# Altium schematic sheet HK32L08x-EVAL.SchDoc
size A3
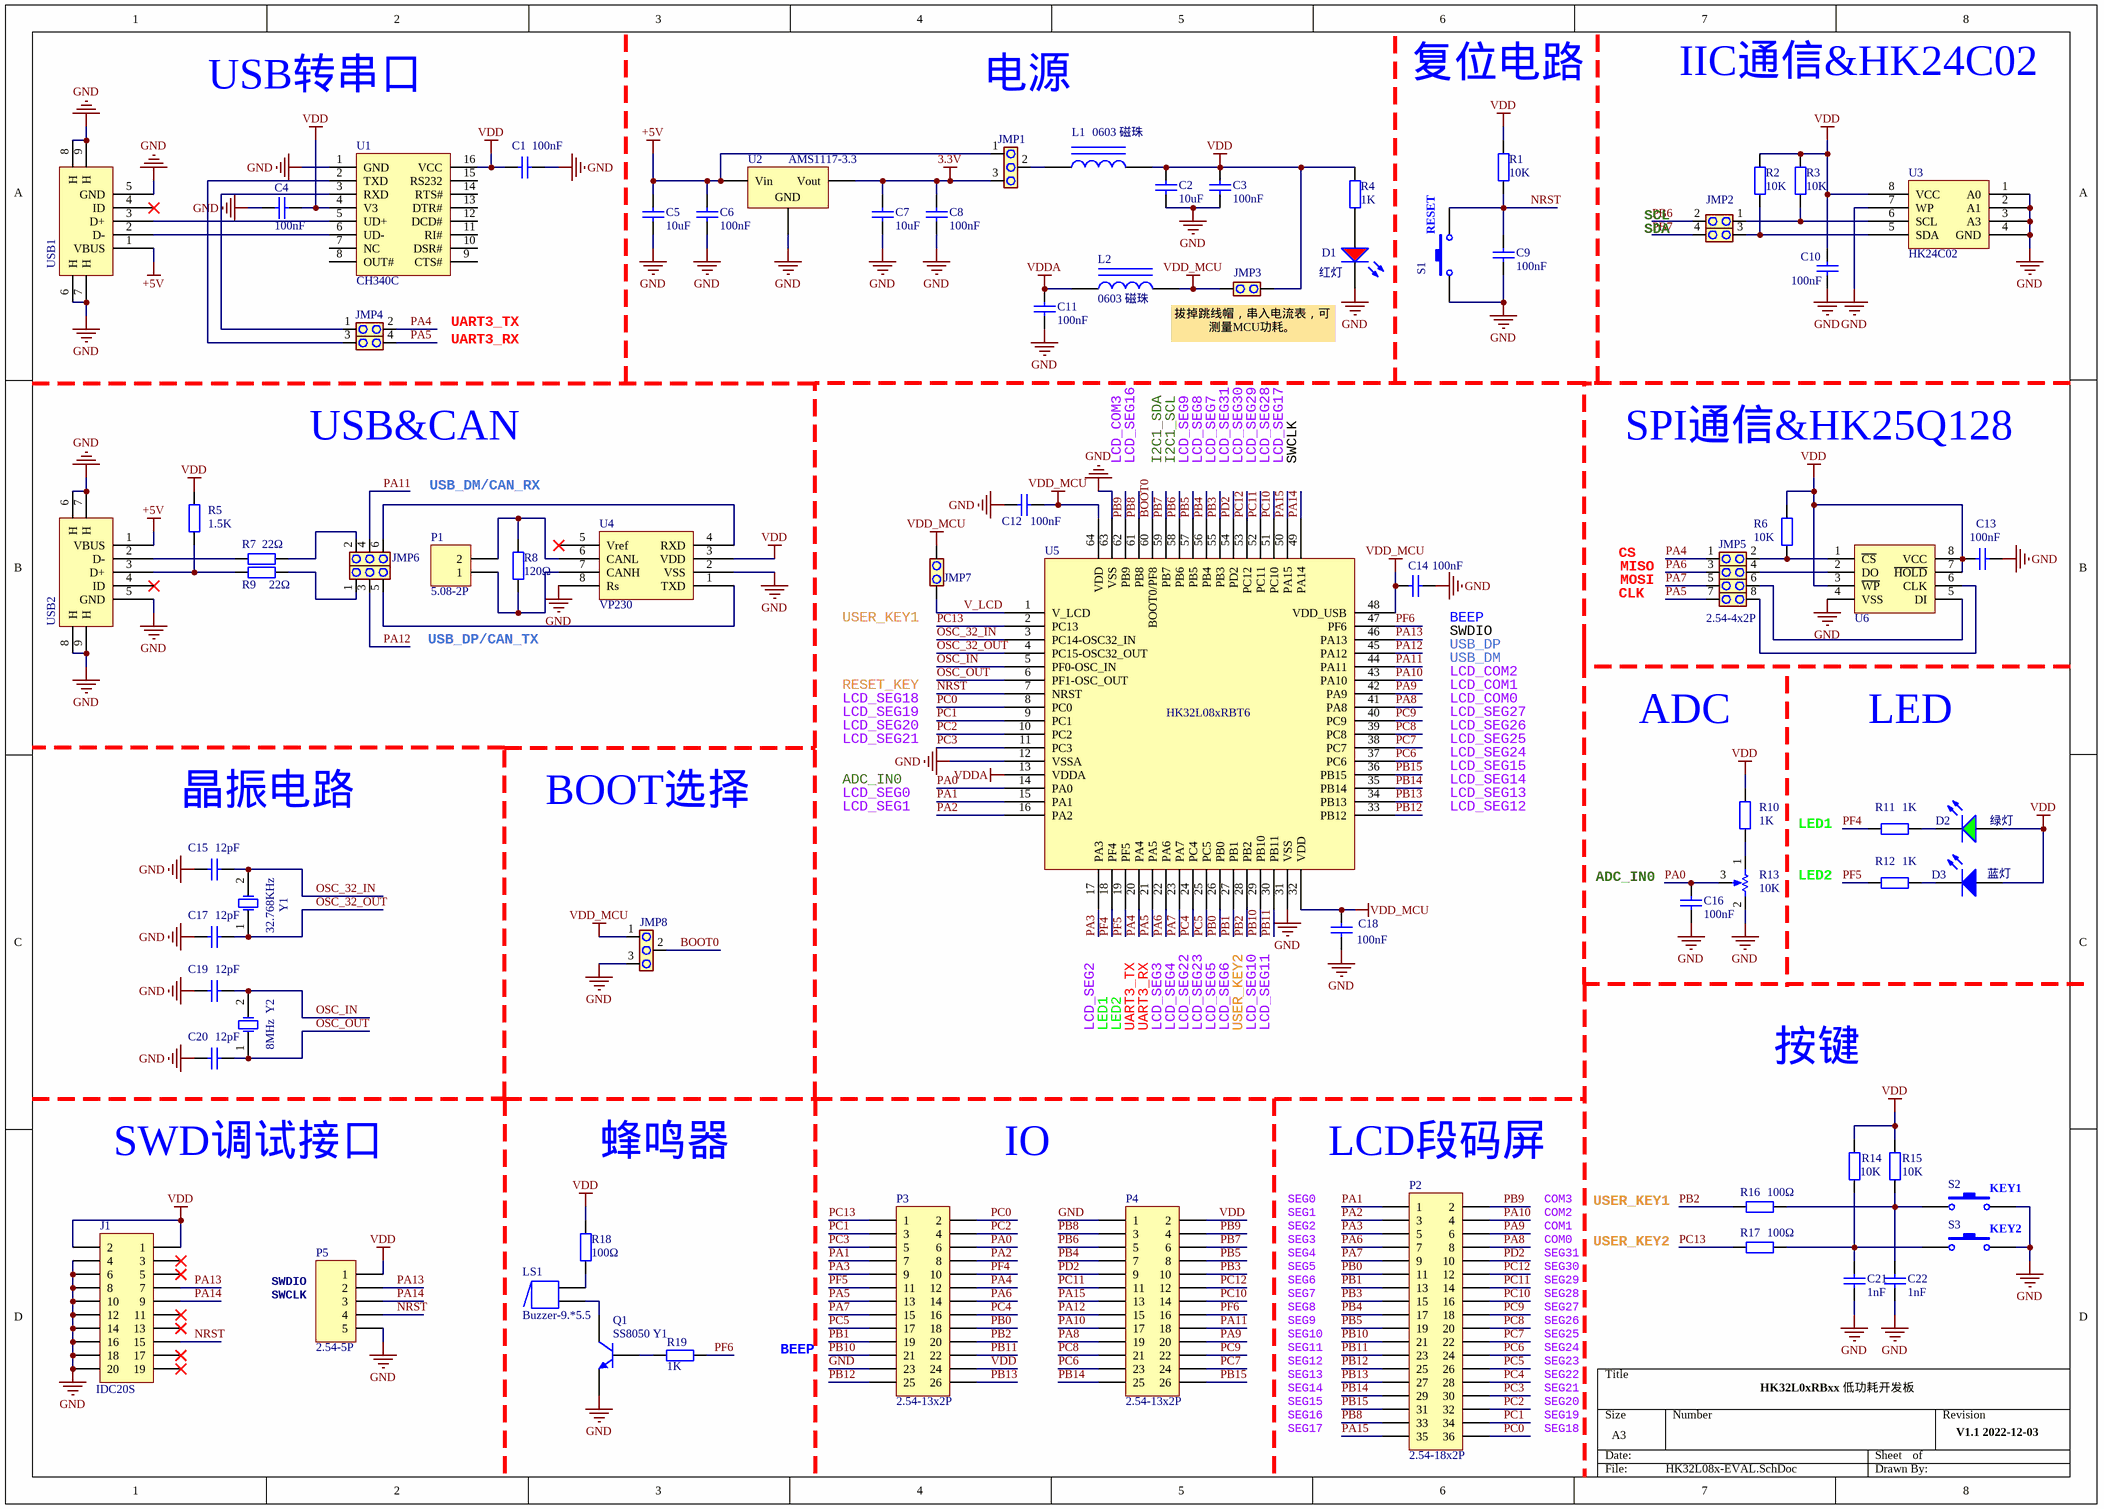
[diagram p0: HK32L08x-EVAL.SchDoc]

## Parts
C1  100nF  [LC-0603_C]
C2  10uF  [LC-0603_C]
C3  100nF  [LC-0603_C]
C4  100nF  [LC-0603_C]
C5  10uF  [LC-1206_C]
C6  100nF  [LC-0603_C]
C7  10uF  [LC-1206_C]
C8  100nF  [LC-0603_C]
C9  100nF  [LC-0603_C]
C10  100nF  [LC-0603_C]
C11  100nF  [LC-0603_C]
C12  100nF  [LC-0603_C]
C13  100nF  [LC-0603_C]
C14  100nF  [LC-0603_C]
C15  12pF  [LC-0603_C]
C16  100nF  [LC-0603_C]
C17  12pF  [LC-0603_C]
C18  100nF  [LC-0603_C]
C19  12pF  [LC-0603_C]
C20  12pF  [LC-0603_C]
C21  1nF  [LC-0603_C]
C22  1nF  [LC-0603_C]
D1  红灯  [LC-0603_LED_S1]
D2  绿灯  [LC-0603_LED_S1]
D3  蓝灯  [LC-0603_LED_S1]
J1  IDC20S  [JTAG20P]
JMP1  2.54-3P  [HDR1X3]  (value not drawn)
JMP2  2.54-2x2P  [HDR2X2]  (value not drawn)
JMP3  2.54-2x1  [HDR1X2]  (value not drawn)
JMP4  2.54-2x2P  [HDR2X2]  (value not drawn)
JMP5  2.54-4x2P  [HDR2X4]
JMP6  2.54-3x2P  [HDR2X3]  (value not drawn)
JMP7  2.54-2P  [HDR1X2]  (value not drawn)
JMP8  2.54-3P  [HDR1X3]  (value not drawn)
L1  0603 磁珠  [LC-0603_L]
L2  0603 磁珠  [LC-0603_L]
LS1  Buzzer-9.*5.5  [Buzzer-2P-9x5.5]
P1  5.08-2P  [HD-2PIN-5.08]
P2  2.54-18x2P  [LCD128_2x18-2.54]
P3  2.54-13x2P  [HDR2X13]
P4  2.54-13x2P  [HDR2X13]
P5  2.54-5P  [HDR1X5]
Q1  SS8050 Y1  [LC-SOT-23(SOT-23-3)]
R1  10K  [LC-0603_R]
R2  10K  [LC-0603_R]
R3  10K  [LC-0603_R]
R4  1K  [LC-0603_R]
R5  1.5K  [LC-0603_R]
R6  10K  [LC-0603_R]
R7  22Ω  [LC-0603_R]
R8  120Ω  [LC-0603_R]
R9  22Ω  [LC-0603_R]
R10  1K  [LC-0603_R]
R11  1K  [LC-0603_R]
R12  1K  [LC-0603_R]
R13  value 10K  [VR-3P]  (hidden comment: 3386P-1)
R14  10K  [LC-0603_R]
R15  10K  [LC-0603_R]
R16  100Ω  [LC-0603_R]
R17  100Ω  [LC-0603_R]
R18  100Ω  [LC-0603_R]
R19  1K  [LC-0603_R]
S1  KEY-3*6*2.5  [SMD_KEY-2P]  (value not drawn)
S2  KEY-3*6*2.5  [SMD_KEY-2P]  (value not drawn)
S3  KEY-3*6*2.5  [SMD_KEY-2P]  (value not drawn)
U1  CH340C  [LC-SOIC-16_150mil]
U2  AMS1117-3.3  [LC-SOT-223]
U3  HK24C02  [LC-SOIC-8_150mil]
U4  VP230  [LC-SOIC-8_150mil]
U5  HK32L08xRBT6  [LC-LQFP-64_10x10x05P]
U6  HK25Q128  [FLASH-SOP8L]  (value not drawn)
USB1  MINI-USB  [mini_USB]  (value not drawn)
USB2  MINI-USB  [mini_USB]  (value not drawn)
Y1  32.768KHz  [JZ32768]
Y2  8MHz  [JZ49S]

## Nets
3.3V: C7.2 C8.2 JMP1.3 U2.2(Vout)
+5V: C5.2 C6.2 JMP1.1 U2.3(Vin) USB1.1(VBUS) USB2.1(VBUS)
GND: C1.1 C2.1 C3.1 C4.2 C5.1 C6.1 C7.1 C8.1 C9.1 C10.1 C11.1 C12.2 C13.1 C14.2 C15.1 C16.2 C17.1 C18.2 C19.1 C20.1 C21.1 C22.1 D1.K J1.4 J1.6 J1.8 J1.10 J1.12 J1.14 J1.16 J1.18 J1.20 JMP8.3 P3.23 P4.1 P5.5 Q1.2(E) R13.2(BOT) S1.1 S2.2 S3.2 U1.1(GND) U2.1(GND) U3.1(A0) U3.2(A1) U3.3(A3) U3.4(GND) U3.7(WP) U4.2(VSS) U4.8(Rs) U5.12(VSSA) U5.31(VSS) U5.63(VSS) U6.4(VSS) USB1.5(GND) USB1.6(H) USB1.7(H) USB1.8(H) USB1.9(H) USB2.5(GND) USB2.6(H) USB2.7(H) USB2.8(H) USB2.9(H)
VDD: C1.2 C2.2 C3.2 C4.1 C10.2 C13.2 D2.A D3.A J1.1 J1.2 JMP3.1 L1.2 P3.24 P4.2 P5.1 R1.2 R2.2 R3.2 R4.2 R5.2 R6.2 R10.2 R14.2 R15.2 R18.2 U1.4(V3) U1.16(VCC) U3.8(VCC) U4.3(VDD) U6.3(~{WP}) U6.7(~{HOLD}) U6.8(VCC)
VDD_MCU: C12.1 C14.1 C18.1 JMP3.2 JMP7.1 JMP8.1 L2.1 U5.32(VDD) U5.48(VDD_USB) U5.64(VDD)
VDDA: C11.2 L2.2 U5.13(VDDA)
BOOT0: JMP8.2 U5.60(BOOT0/PF8)
NRST: C9.2 J1.15 P5.4 R1.1 S1.2 U5.7(NRST)
OSC_32_IN: C15.2 U5.3(PC14-OSC32_IN) Y1.2(OSC2)
OSC_32_OUT: C17.2 U5.4(PC15-OSC32_OUT) Y1.1(OSC1)
OSC_IN: C19.2 U5.5(PF0-OSC_IN) Y2.2(OSC2)
OSC_OUT: C20.2 U5.6(PF1-OSC_OUT) Y2.1(OSC1)
PA0: C16.1 P3.6 R13.3(TAP) U5.14(PA0)
PA1: P2.1 P3.7 U5.15(PA1)
PA2: P2.3 P3.8 U5.16(PA2)
PA3: P2.5 P3.9 U5.17(PA3)
PA4: JMP4.2 JMP5.1 P3.12 U5.20(PA4)
PA5: JMP4.4 JMP5.7 P3.13 U5.21(PA5)
PA6: JMP5.3 P2.7 P3.14 U5.22(PA6)
PA7: JMP5.5 P2.9 P3.15 U5.23(PA7)
PA8: P2.8 P4.19 U5.41(PA8)
PA9: P2.6 P4.20 U5.42(PA9)
PA10: P2.4 P4.17 U5.43(PA10)
PA11: JMP6.4 P4.18 U5.44(PA11)
PA12: JMP6.3 P4.15 U5.45(PA12)
PA13: J1.7 P5.2 U5.46(PA13)
PA14: J1.9 P5.3 U5.49(PA14)
PA15: P2.35 P4.13 U5.50(PA15)
PB0: P2.11 P3.18 U5.26(PB0)
PB1: P2.13 P3.19 U5.27(PB1)
PB2: P3.20 R16.1 U5.28(PB2)
PB3: P2.15 P4.10 U5.55(PB3)
PB4: P2.17 P4.7 U5.56(PB4)
PB5: P2.19 P4.8 U5.57(PB5)
PB6: JMP2.2 P4.5 U5.58(PB6)
PB7: JMP2.4 P4.6 U5.59(PB7)
PB8: P2.33 P4.3 U5.61(PB8)
PB9: P2.2 P4.4 U5.62(PB9)
PB10: P2.21 P3.21 U5.29(PB10)
PB11: P2.23 P3.22 U5.30(PB11)
PB12: P2.25 P3.25 U5.33(PB12)
PB13: P2.27 P3.26 U5.34(PB13)
PB14: P2.29 P4.25 U5.35(PB14)
PB15: P2.31 P4.26 U5.36(PB15)
PC0: P2.36 P3.2 U5.8(PC0)
PC1: P2.34 P3.3 U5.9(PC1)
PC2: P2.32 P3.4 U5.10(PC2)
PC3: P2.30 P3.5 U5.11(PC3)
PC4: P2.28 P3.16 U5.24(PC4)
PC5: P2.26 P3.17 U5.25(PC5)
PC6: P2.24 P4.23 U5.37(PC6)
PC7: P2.22 P4.24 U5.38(PC7)
PC8: P2.20 P4.21 U5.39(PC8)
PC9: P2.18 P4.22 U5.40(PC9)
PC10: P2.16 P4.14 U5.51(PC10)
PC11: P2.14 P4.11 U5.52(PC11)
PC12: P2.12 P4.12 U5.53(PC12)
PC13: P3.1 R17.1 U5.2(PC13)
PD2: P2.10 P4.9 U5.54(PD2)
PF4: P3.10 R11.2 U5.18(PF4)
PF5: P3.11 R12.2 U5.19(PF5)
PF6: P4.16 R19.1 U5.47(PF6)
V_LCD: JMP7.2 U5.1(V_LCD)
NetC21_2: C21.2 R14.1 R17.2 S3.1
NetC22_2: C22.2 R15.1 R16.2 S2.1
NetD1_A: D1.A R4.1
NetD2_K: D2.K R11.1
NetD3_K: D3.K R12.1
NetJMP1_2: JMP1.2 L1.1
NetJMP2_1: JMP2.1 R3.1 U3.6(SCL)
NetJMP2_3: JMP2.3 R2.1 U3.5(SDA)
NetJMP4_1: JMP4.1 U1.3(RXD)
NetJMP4_3: JMP4.3 U1.2(TXD)
NetJMP5_2: JMP5.2 R6.1 U6.1(~{CS})
NetJMP5_4: JMP5.4 U6.2(DO)
NetJMP5_6: JMP5.6 U6.5(DI)
NetJMP5_8: JMP5.8 U6.6(CLK)
NetJMP6_1: JMP6.1 R9.2
NetJMP6_2: JMP6.2 R7.2
NetJMP6_5: JMP6.5 U4.1(TXD)
NetJMP6_6: JMP6.6 U4.4(RXD)
NetLS1_1: LS1.1 R18.1
NetLS1_2: LS1.2 Q1.3(C)
NetP1_1: P1.1 R8.1 U4.7(CANH)
NetP1_2: P1.2 R8.2 U4.6(CANL)
NetQ1_1: Q1.1(B) R19.2
NetR5_1: R5.1 R9.1 USB2.3(D+)
NetR7_1: R7.1 USB2.2(D-)
NetR10_1: R10.1 R13.1(TOP)
NetU1_5: U1.5(UD+) USB1.3(D+)
NetU1_6: U1.6(UD-) USB1.2(D-)

Not connected (* = marked no-connect by the designer): J1 3* 5* 11* 13* 17* 19*; U1 7(NC) 8(OUT#) 9(CTS#) 10(DSR#) 11(RI#) 12(DCD#) 13(DTR#) 14(RTS#) 15(RS232); U4 5(Vref)*; USB1 4(ID)*; USB2 4(ID)*

## Notes on the sheet
- USB转串口
- 电源
- 复位电路
- IIC通信&HK24C02
- (near S1) RESET
- SDA
- SCL
- UART3_TX
- UART3_RX
- 拔掉跳线帽，串入电流表，可测量MCU功耗。
- USB&CAN
- SPI通信&HK25Q128
- USB_DM/CAN_RX
- LCD_COM3
- LCD_SEG16
- I2C1_SDA
- I2C1_SCL
- LCD_SEG9
- LCD_SEG8
- LCD_SEG7
- LCD_SEG31
- LCD_SEG30
- LCD_SEG29
- LCD_SEG28
- LCD_SEG17
- SWCLK
- CS
- MISO
- MOSI
- USB_DP/CAN_TX
- (near JMP7) USER_KEY1
- (near C14) SWDIO
- USB_DP
- (near C14) BEEP
- CLK
- LCD_SEG18
- LCD_SEG19
- RESET_KEY
- LCD_SEG27
- LCD_COM0
- LCD_COM1
- LCD_COM2
- USB_DM
- LCD_SEG20
- LCD_SEG21
- ADC_IN0
- LCD_SEG14
- LCD_SEG24
- LCD_SEG25
- LCD_SEG26
- LCD_SEG15
- ADC
- LED
- 晶振电路
- BOOT选择
- LCD_SEG0
- LCD_SEG1
- LCD_SEG12
- LCD_SEG13
- LED1
- (near C16) ADC_IN0
- LED2
- LCD_SEG2
- LCD_SEG3
- LCD_SEG4
- LCD_SEG22
- LCD_SEG23
- LCD_SEG5
- LCD_SEG6
- USER_KEY2
- LCD_SEG10
- LCD_SEG11
- 按键
- SWD调试接口
- 蜂鸣器
- IO
- (near P2) LCD段码屏
- (near S2) KEY1
- SEG0
- SEG1
- SEG2
- SEG3
- SEG4
- COM0
- COM1
- COM2
- COM3
- SEG31
- USER_KEY1
- KEY2
- SWDIO
- SEG7
- SEG5
- SEG6
- SEG9
- SEG8
- SEG29
- SEG30
- SEG26
- SEG27
- SEG28
- BEEP
- SEG13
- SEG14
- SEG10
- SEG11
- SEG12
- SEG22
- SEG21
- SEG25
- SEG24
- SEG23
- HK32L0xRBxx 低功耗开发板
- SEG15
- SEG16
- SEG17
- SEG20
- SEG19
- SEG18
- V1.1 2022-12-03

## Library data of the parts
C1 C3 C4 C6 C8-C14 C16 C18 = 0603 100nF (104) 10% 50V: 贴片电容; ComponentLink1Description: 供应商链接; ComponentLink1URL: http://www.szlcsc.com/product/details_15331.html; Package: 0603; Supplier: LC; SuppliersPartNumber: C14663
C2 = 0603 10uF (106) 10% 10V: 贴片电容; ComponentLink1Description: 供应商链接; ComponentLink1URL: http://www.szlcsc.com/product/details_20411.html; Package: 0603; Supplier: LC; SuppliersPartNumber: C19702
C5 C7 = 1206 10uF (106) 10% 50V: 贴片电容; ComponentLink1Description: 供应商链接; ComponentLink1URL: http://www.szlcsc.com/product/details_14236.html; Package: 1206; Supplier: LC; SuppliersPartNumber: C13585
C15 C17 C19 C20 = 0603 12pF (120) 5% 50V: 贴片电容; ComponentLink1Description: 供应商链接; ComponentLink1URL: http://www.szlcsc.com/product/details_39506.html; Package: 0603; Supplier: LC; SuppliersPartNumber: C38523
C21 C22 = 0603 1nF (102) 10% 50V: 贴片电容; ComponentLink1Description: 供应商链接; ComponentLink1URL: http://www.szlcsc.com/product/details_1940.html; Package: 0603; Supplier: LC; SuppliersPartNumber: C1588
D1 = 0603 红灯: 贴片LED; ComponentLink1Description: 供应商链接; ComponentLink1URL: http://www.szlcsc.com/product/details_2659.html; Package: 0603; Supplier: LC; SuppliersPartNumber: C2286
D2 = 0603 绿灯: 贴片LED; ComponentLink1Description: 供应商链接; ComponentLink1URL: http://www.szlcsc.com/product/details_73152.html; Package: 0603; Supplier: LC; SuppliersPartNumber: C72043
D3 = 0603 蓝灯: 贴片LED; ComponentLink1Description: 供应商链接; ComponentLink1URL: http://www.szlcsc.com/product/details_73150.html; Package: 0603; Supplier: LC; SuppliersPartNumber: C72041
J1 = Header 10X2H: 接插件; LatestRevisionDate: 17-Jul-2002; LatestRevisionNote: Re-released for DXP Platform.; Publisher: Altium Limited
JMP1 JMP8 = JMP-3P: 排针
JMP2 JMP4 = JMP-2-2P: 排针
JMP3 JMP7 = JMP-2P: 排针
JMP5 = JMP-2x4P: 排针
JMP6 = JMP-2x3P: 排针
L1 L2 = 0603 10uH 10%: 贴片电感; ComponentLink1Description: 供应商链接; ComponentLink1URL: http://www.szlcsc.com/product/details_1387.html; Package: 0603; Supplier: LC; SuppliersPartNumber: C1035
LS1 = Buzzer: 直插蜂鸣器; Published: 24-Mar-1999; LatestRevisionDate: 17-Dec-2003; LatestRevisionNote: Schematic revised, PCB Footprint replaced.; DatasheetVersion: 17-Dec-2003; PackageReference: ABSM-1574; Publisher: Altium Limited; PackageDescription: Magnetic Transducer Buzzer; ComponentLink1Description: Manufacturer Link; ComponentLink1URL: http://www.megastar.com/linecard/buzzmode/index.php
P1 = Header 2: 接插件; LatestRevisionDate: 17-Jul-2002; LatestRevisionNote: Re-released for DXP Platform.; Publisher: Altium Limited
P2 = Header 18X2: 排母; LatestRevisionDate: 17-Jul-2002; LatestRevisionNote: Re-released for DXP Platform.; Publisher: Altium Limited
P3 P4 = Header 13X2: 排针; LatestRevisionDate: 17-Jul-2002; LatestRevisionNote: Re-released for DXP Platform.; Publisher: Altium Limited
P5 = Header 5: 排针; LatestRevisionDate: 17-Jul-2002; LatestRevisionNote: Re-released for DXP Platform.; Publisher: Altium Limited
Q1 = SOT-23 SS8050 Y1: 贴片三极管; ComponentLink1Description: 供应商链接; ComponentLink1URL: http://www.szlcsc.com/product/details_2507.html; Package: SOT-23; Supplier: LC; SuppliersPartNumber: C2150
R1-R3 R6 R14 R15 = 0603 10KΩ (1002) 1%: 贴片电阻; ComponentLink1Description: 供应商链接; ComponentLink1URL: http://www.szlcsc.com/product/details_26547.html; Package: 0603; Supplier: LC; SuppliersPartNumber: C25804
R4 R10-R12 R19 = 0603 1KΩ (1001) 1%: 贴片电阻; ComponentLink1Description: 供应商链接; ComponentLink1URL: http://www.szlcsc.com/product/details_21904.html; Package: 0603; Supplier: LC; SuppliersPartNumber: C21190
R5 = 0603 1.5KΩ (1501) 1%: 贴片电阻; ComponentLink1Description: 供应商链接; ComponentLink1URL: http://www.szlcsc.com/product/details_23570.html; Package: 0603; Supplier: LC; SuppliersPartNumber: C22843
R7 R9 = 0603 22Ω (22R0) 1%: 贴片电阻; ComponentLink1Description: 供应商链接; ComponentLink1URL: http://www.szlcsc.com/product/details_24078.html; Package: 0603; Supplier: LC; SuppliersPartNumber: C23345
R8 = 0603 120Ω (1200) 1%: 贴片电阻; ComponentLink1Description: 供应商链接; ComponentLink1URL: http://www.szlcsc.com/product/details_23514.html; Package: 0603; Supplier: LC; SuppliersPartNumber: C22787
R13 = RPot: 直插电位器; Sim Note: Enter the Resistance value and the set point into parameter fields.; Set Position: 0.5; Published: 8-Jun-2000; LatestRevisionDate: 17-Jul-2002; LatestRevisionNote: Re-released for DXP Platform.; PackageReference: VR5; Publisher: Altium Limited; PackageDescription: Variable Resistor, Thru-Hole; 3 Leads
R16-R18 = 0603 100Ω (1000) 1%: 贴片电阻; ComponentLink1Description: 供应商链接; ComponentLink1URL: http://www.szlcsc.com/product/details_23502.html; Package: 0603; Supplier: LC; SuppliersPartNumber: C22775
S1-S3 = SW-PB: 贴片按键; Published: 24-Mar-1999; LatestRevisionDate: 17-Jul-2002; LatestRevisionNote: Re-released for DXP Platform.; PackageReference: SPST-2; Publisher: Altium Limited; PackageDescription: Switch; 2 Leads
U1 = CH340C: 贴片IC
U2 = SOT-223 AMS1117-3.3: 贴片IC; ComponentLink1Description: 供应商链接; ComponentLink1URL: http://www.szlcsc.com/product/details_6652.html; Package: SOT-223; Supplier: LC; SuppliersPartNumber: C6186
U3 = EEPROM/AT24C256C-SSHL-T: 贴片IC; ComponentLink1Description: 供应商链接; ComponentLink1URL: http://www.szlcsc.com/product/details_6947.html; Package: SOIC-8_150mil; Supplier: LC; SuppliersPartNumber: C6482
U4 = VP230: 贴片IC
U5 = HK32L08xRBT6: 贴片IC
U6 = HK25Q128: 贴片IC
USB1 USB2 = MINI-USB: 接插件
Y1 = SMD-3215_2P 32.768KHz 20ppm 12.5pF: 直插晶振; ComponentLink1Description: 供应商链接; ComponentLink1URL: http://www.szlcsc.com/product/details_33310.html; Package: SMD-3215_2P; Supplier: LC; SuppliersPartNumber: C32346
Y2 = SMD-5032_2P 8MHz 20ppm 20pF: 直插晶振; ComponentLink1Description: 供应商链接; ComponentLink1URL: http://www.szlcsc.com/product/details_19261.html; Package: SMD-5032_2P; Supplier: LC; SuppliersPartNumber: C18560